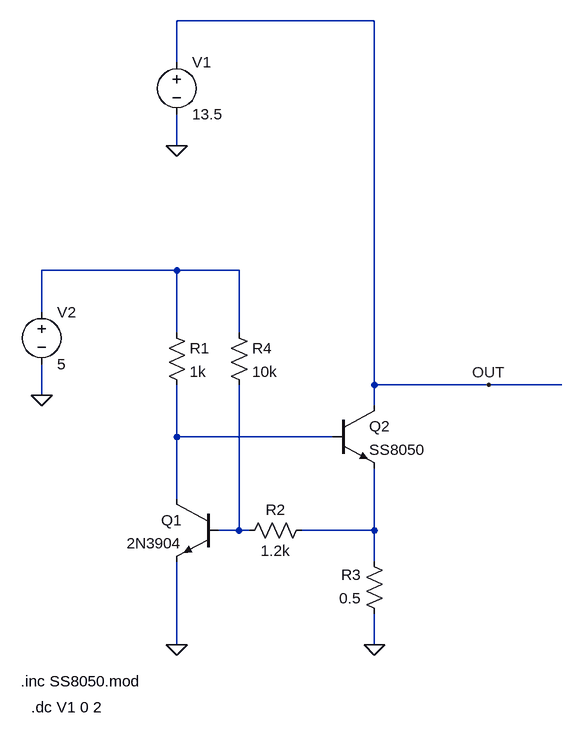
[diagram p0: schematic high_current_low_dropout.asc]
high_current_low_dropout.asc, the LTspice schematic file:
Version 4
SHEET 1 880 752
WIRE -544 -320 -848 -320
WIRE -848 -256 -848 -320
WIRE -848 -128 -848 -176
WIRE -848 64 -1056 64
WIRE -752 64 -848 64
WIRE -1056 128 -1056 64
WIRE -848 160 -848 64
WIRE -752 160 -752 64
WIRE -544 240 -544 -320
WIRE -368 240 -544 240
WIRE -256 240 -368 240
WIRE -1056 256 -1056 208
WIRE -544 272 -544 240
WIRE -848 320 -848 240
WIRE -608 320 -848 320
WIRE -848 416 -848 320
WIRE -752 464 -752 240
WIRE -752 464 -784 464
WIRE -736 464 -752 464
WIRE -544 464 -544 368
WIRE -544 464 -656 464
WIRE -544 512 -544 464
WIRE -848 640 -848 512
WIRE -544 640 -544 592
FLAG -848 640 0
FLAG -544 640 0
FLAG -848 -128 0
FLAG -1056 256 0
FLAG -368 240 OUT
SYMBOL res -864 144 R0
SYMATTR InstName R1
SYMATTR Value 1k
SYMBOL npn -784 416 M0
SYMATTR InstName Q1
SYMATTR Value 2N3904
SYMBOL npn -608 272 R0
SYMATTR InstName Q2
SYMATTR Value SS8050
SYMBOL res -640 448 R90
WINDOW 0 0 56 VBottom 2
WINDOW 3 32 56 VTop 2
SYMATTR InstName R2
SYMATTR Value 1.2k
SYMBOL res -528 608 R180
WINDOW 0 36 76 Left 2
WINDOW 3 36 40 Left 2
SYMATTR InstName R3
SYMATTR Value 0.5
SYMBOL voltage -848 -272 R0
SYMATTR InstName V1
SYMATTR Value 13.5
SYMBOL voltage -1056 112 R0
SYMATTR InstName V2
SYMATTR Value 5
SYMBOL res -768 144 R0
SYMATTR InstName R4
SYMATTR Value 10k
TEXT -1088 696 Left 2 !.inc SS8050.mod
TEXT -1072 736 Left 2 !.dc V1 0 2

The netlist it stands for:
* high_current_low_dropout.asc
R1 N001 N002 1k
Q1 N002 N003 0 0 2N3904
Q2 OUT N002 N004 0 SS8050
R2 N004 N003 1.2k
R3 0 N004 0.5
V1 OUT 0 13.5
V2 N001 0 5
R4 N001 N003 10k
.model NPN NPN
.model PNP PNP
.lib standard.bjt
.inc SS8050.mod
.dc V1 0 2
.backanno
.end